# EAGLE schematic ArduSatMultipleProcessorModule (EAGLE 6.3)
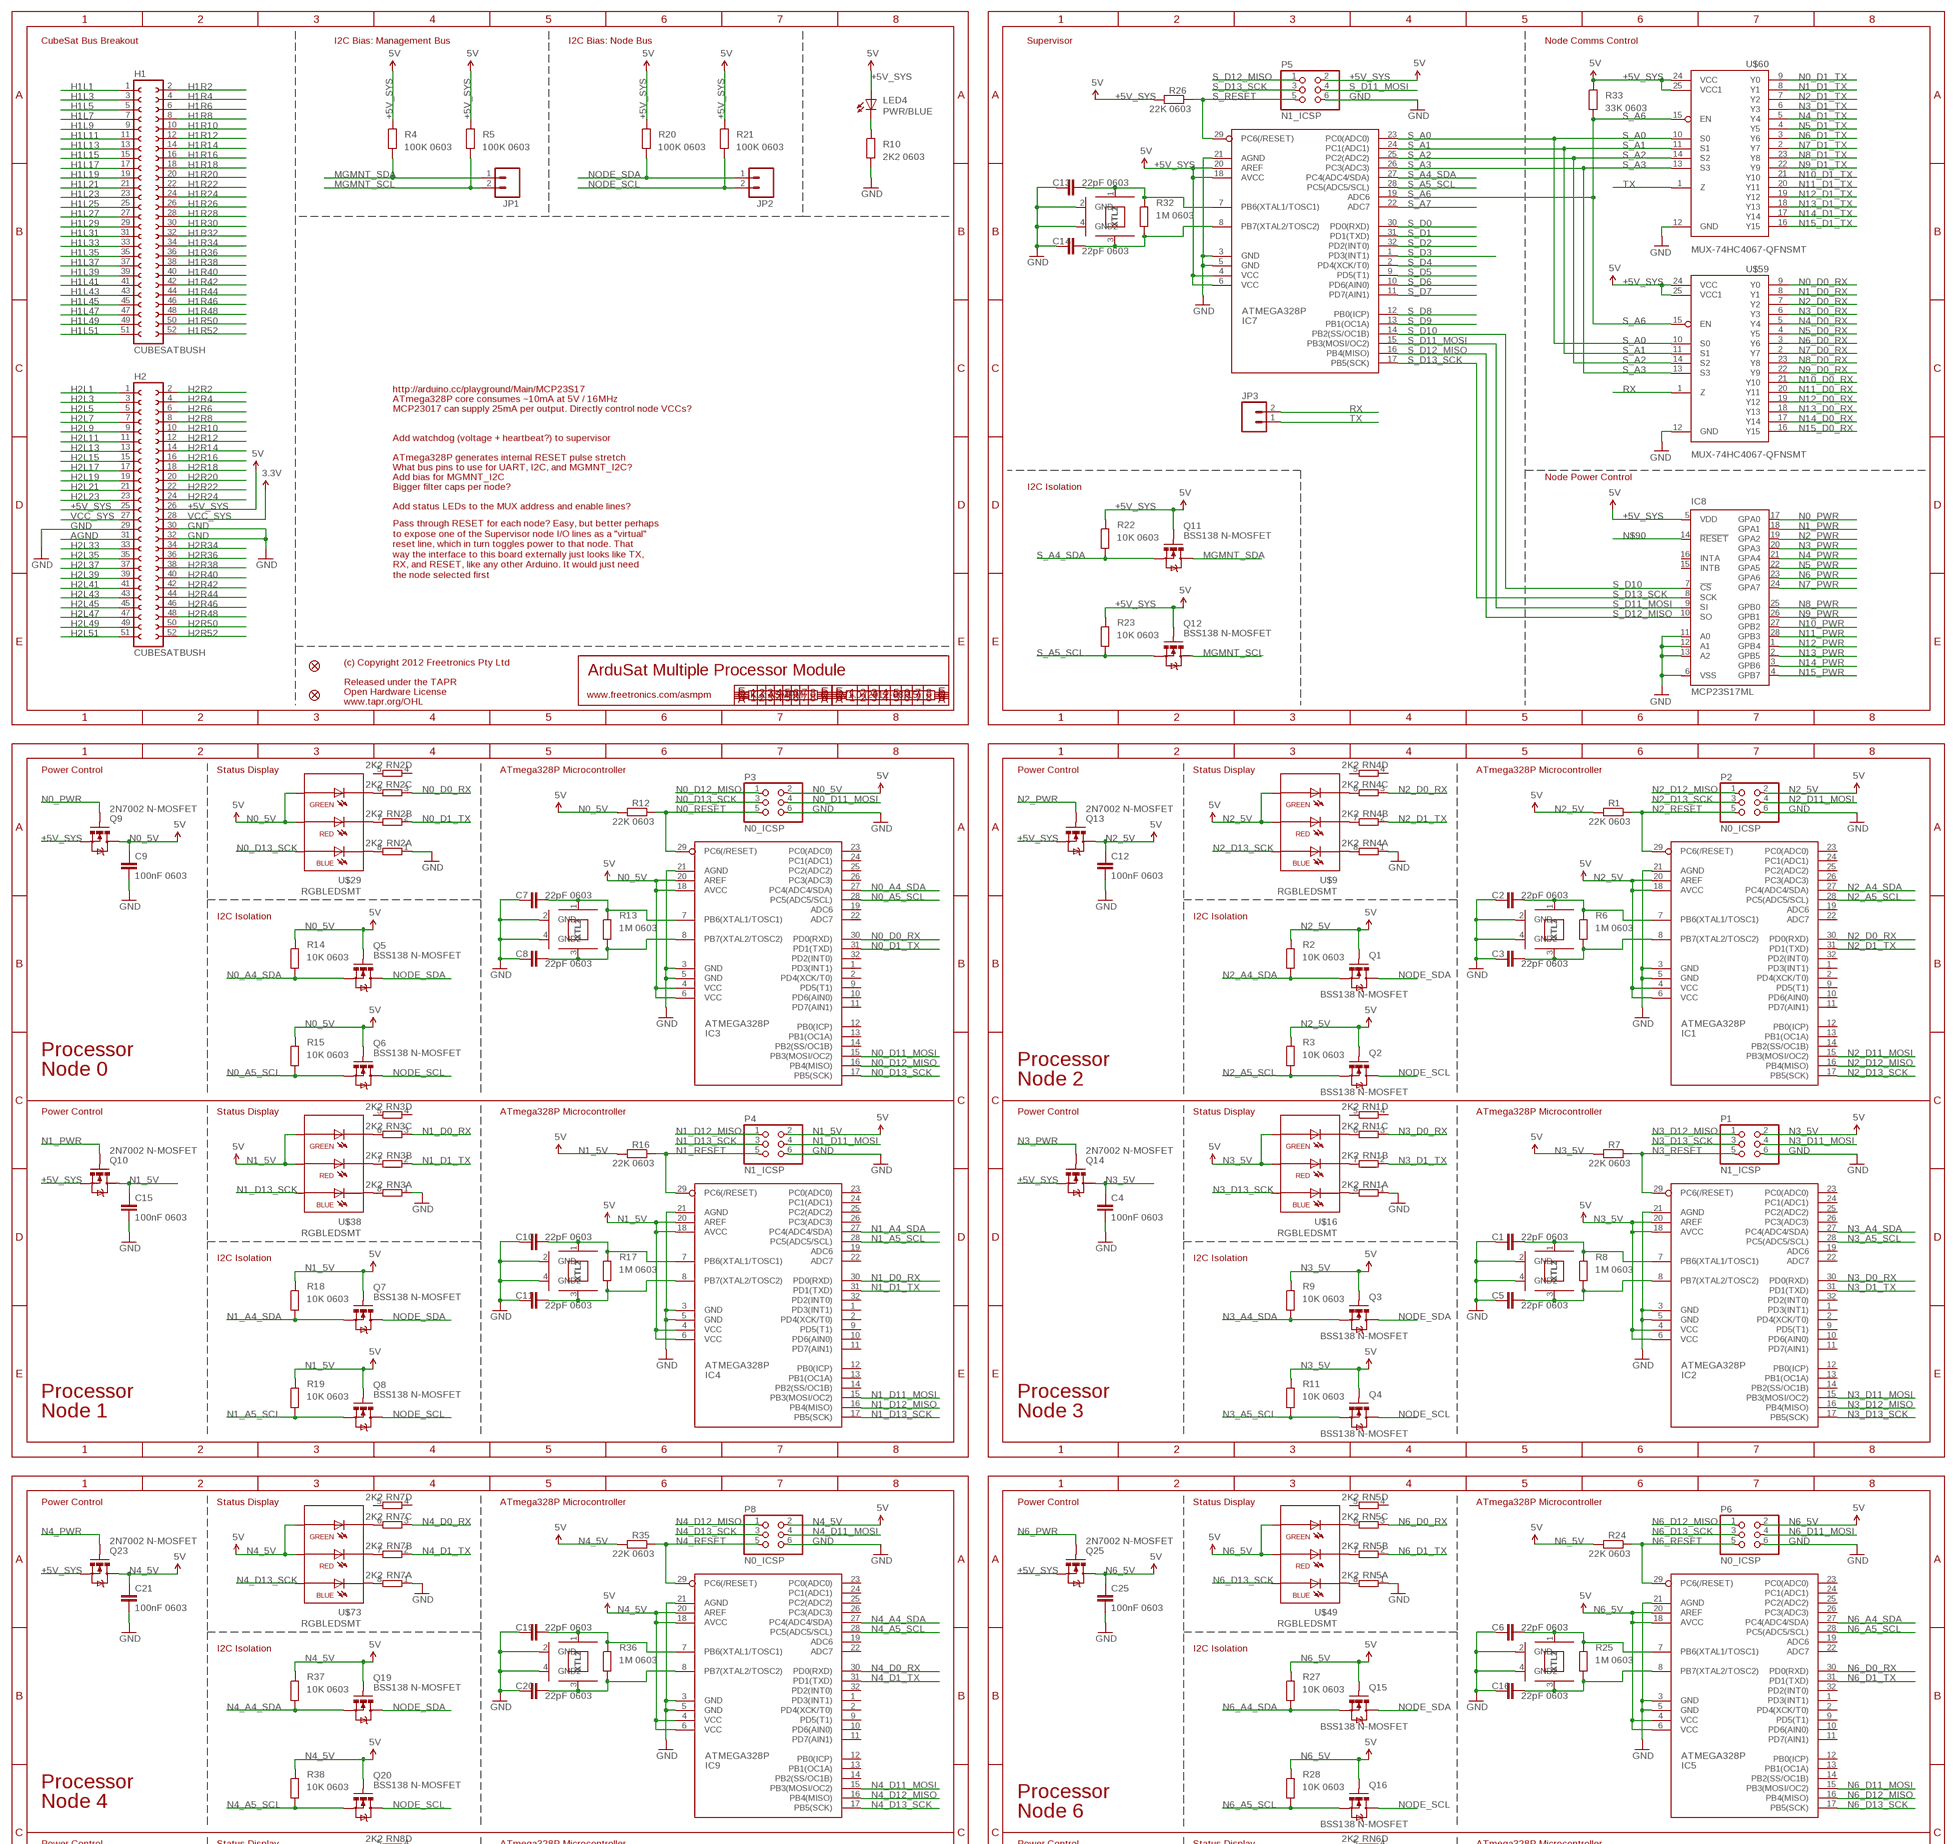
[diagram p0: schematic, sheet 1, part 1 of 2]
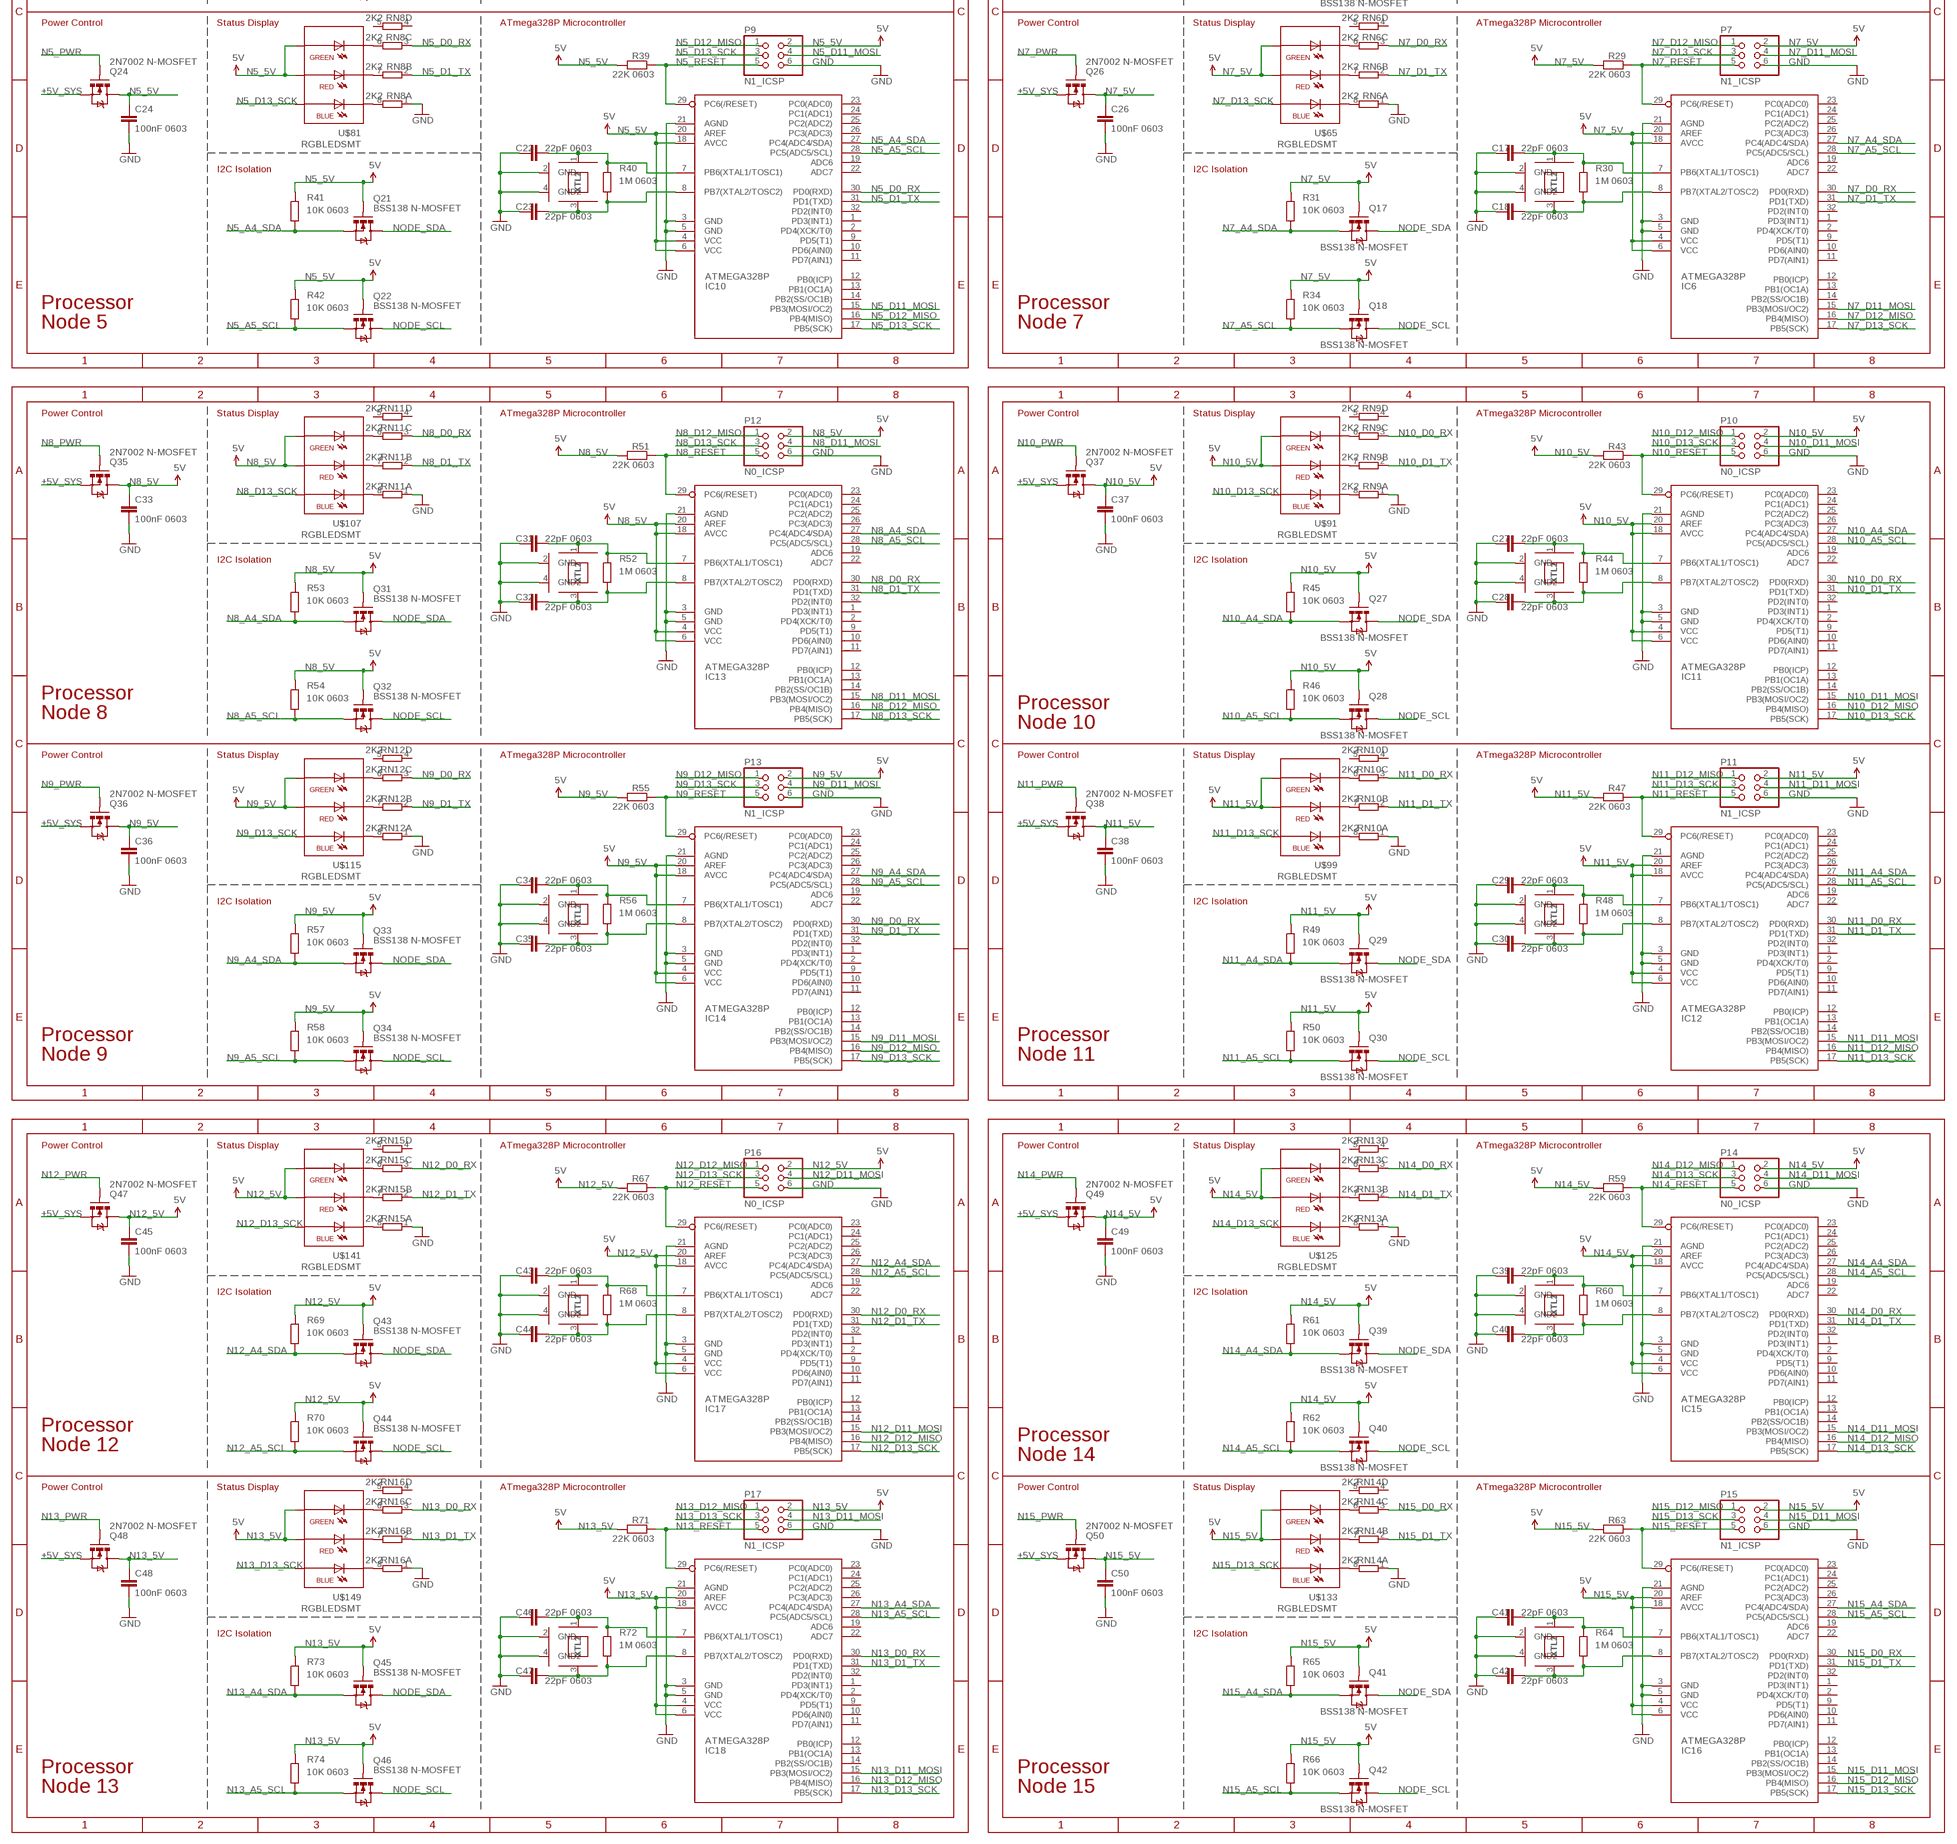
[diagram p1: schematic, sheet 1, part 2 of 2]

## Parts
C1  22pF 0603  CAP0603  [0603]
C2  22pF 0603  CAP0603  [0603]
C3  22pF 0603  CAP0603  [0603]
C4  100nF 0603  CAP0603  [0603]
C5  22pF 0603  CAP0603  [0603]
C6  22pF 0603  CAP0603  [0603]
C7  22pF 0603  CAP0603  [0603]
C8  22pF 0603  CAP0603  [0603]
C9  100nF 0603  CAP0603  [0603]
C10  22pF 0603  CAP0603  [0603]
C11  22pF 0603  CAP0603  [0603]
C12  100nF 0603  CAP0603  [0603]
C13  22pF 0603  CAP0603  [0603]
C14  22pF 0603  CAP0603  [0603]
C15  100nF 0603  CAP0603  [0603]
C16  22pF 0603  CAP0603  [0603]
C17  22pF 0603  CAP0603  [0603]
C18  22pF 0603  CAP0603  [0603]
C19  22pF 0603  CAP0603  [0603]
C20  22pF 0603  CAP0603  [0603]
C21  100nF 0603  CAP0603  [0603]
C22  22pF 0603  CAP0603  [0603]
C23  22pF 0603  CAP0603  [0603]
C24  100nF 0603  CAP0603  [0603]
C25  100nF 0603  CAP0603  [0603]
C26  100nF 0603  CAP0603  [0603]
C27  22pF 0603  CAP0603  [0603]
C28  22pF 0603  CAP0603  [0603]
C29  22pF 0603  CAP0603  [0603]
C30  22pF 0603  CAP0603  [0603]
C31  22pF 0603  CAP0603  [0603]
C32  22pF 0603  CAP0603  [0603]
C33  100nF 0603  CAP0603  [0603]
C34  22pF 0603  CAP0603  [0603]
C35  22pF 0603  CAP0603  [0603]
C36  100nF 0603  CAP0603  [0603]
C37  100nF 0603  CAP0603  [0603]
C38  100nF 0603  CAP0603  [0603]
C39  22pF 0603  CAP0603  [0603]
C40  22pF 0603  CAP0603  [0603]
C41  22pF 0603  CAP0603  [0603]
C42  22pF 0603  CAP0603  [0603]
C43  22pF 0603  CAP0603  [0603]
C44  22pF 0603  CAP0603  [0603]
C45  100nF 0603  CAP0603  [0603]
C46  22pF 0603  CAP0603  [0603]
C47  22pF 0603  CAP0603  [0603]
C48  100nF 0603  CAP0603  [0603]
C49  100nF 0603  CAP0603  [0603]
C50  100nF 0603  CAP0603  [0603]
H1  CUBESATBUSH  [CUBESATBUS]
H2  CUBESATBUSH  [CUBESATBUS]
IC1  ATMEGA328P  AVR-MEGA8-MI  [MLF32]
IC2  ATMEGA328P  AVR-MEGA8-MI  [MLF32]
IC3  ATMEGA328P  AVR-MEGA8-MI  [MLF32]
IC4  ATMEGA328P  AVR-MEGA8-MI  [MLF32]
IC5  ATMEGA328P  AVR-MEGA8-MI  [MLF32]
IC6  ATMEGA328P  AVR-MEGA8-MI  [MLF32]
IC7  ATMEGA328P  AVR-MEGA8-MI  [MLF32]
IC8  MCP23S17ML  [QFN28-ML_6X6MM]
IC9  ATMEGA328P  AVR-MEGA8-MI  [MLF32]
IC10  ATMEGA328P  AVR-MEGA8-MI  [MLF32]
IC11  ATMEGA328P  AVR-MEGA8-MI  [MLF32]
IC12  ATMEGA328P  AVR-MEGA8-MI  [MLF32]
IC13  ATMEGA328P  AVR-MEGA8-MI  [MLF32]
IC14  ATMEGA328P  AVR-MEGA8-MI  [MLF32]
IC15  ATMEGA328P  AVR-MEGA8-MI  [MLF32]
IC16  ATMEGA328P  AVR-MEGA8-MI  [MLF32]
IC17  ATMEGA328P  AVR-MEGA8-MI  [MLF32]
IC18  ATMEGA328P  AVR-MEGA8-MI  [MLF32]
JP1  M02PTH  [1X02]
JP2  M02PTH  [1X02]
JP3  M02PTH  [1X02]
LED4  PWR/BLUE  LED0603  [LED-0603]
P1  N1_ICSP  ICSPPTH  [2X03PTH]
P2  N0_ICSP  ICSPPTH  [2X03PTH]
P3  N0_ICSP  ICSPPTH  [2X03PTH]
P4  N1_ICSP  ICSPPTH  [2X03PTH]
P5  N1_ICSP  ICSPPTH  [2X03PTH]
P6  N0_ICSP  ICSPPTH  [2X03PTH]
P7  N1_ICSP  ICSPPTH  [2X03PTH]
P8  N0_ICSP  ICSPPTH  [2X03PTH]
P9  N1_ICSP  ICSPPTH  [2X03PTH]
P10  N0_ICSP  ICSPPTH  [2X03PTH]
P11  N1_ICSP  ICSPPTH  [2X03PTH]
P12  N0_ICSP  ICSPPTH  [2X03PTH]
P13  N1_ICSP  ICSPPTH  [2X03PTH]
P14  N0_ICSP  ICSPPTH  [2X03PTH]
P15  N1_ICSP  ICSPPTH  [2X03PTH]
P16  N0_ICSP  ICSPPTH  [2X03PTH]
P17  N1_ICSP  ICSPPTH  [2X03PTH]
Q1  BSS138 N-MOSFET  MOSFET-NCHANNELSMD  [SOT23-3]
Q2  BSS138 N-MOSFET  MOSFET-NCHANNELSMD  [SOT23-3]
Q3  BSS138 N-MOSFET  MOSFET-NCHANNELSMD  [SOT23-3]
Q4  BSS138 N-MOSFET  MOSFET-NCHANNELSMD  [SOT23-3]
Q5  BSS138 N-MOSFET  MOSFET-NCHANNELSMD  [SOT23-3]
Q6  BSS138 N-MOSFET  MOSFET-NCHANNELSMD  [SOT23-3]
Q7  BSS138 N-MOSFET  MOSFET-NCHANNELSMD  [SOT23-3]
Q8  BSS138 N-MOSFET  MOSFET-NCHANNELSMD  [SOT23-3]
Q9  2N7002 N-MOSFET  MOSFET-NCHANNELSMD  [SOT23-3]
Q10  2N7002 N-MOSFET  MOSFET-NCHANNELSMD  [SOT23-3]
Q11  BSS138 N-MOSFET  MOSFET-NCHANNELSMD  [SOT23-3]
Q12  BSS138 N-MOSFET  MOSFET-NCHANNELSMD  [SOT23-3]
Q13  2N7002 N-MOSFET  MOSFET-NCHANNELSMD  [SOT23-3]
Q14  2N7002 N-MOSFET  MOSFET-NCHANNELSMD  [SOT23-3]
Q15  BSS138 N-MOSFET  MOSFET-NCHANNELSMD  [SOT23-3]
Q16  BSS138 N-MOSFET  MOSFET-NCHANNELSMD  [SOT23-3]
Q17  BSS138 N-MOSFET  MOSFET-NCHANNELSMD  [SOT23-3]
Q18  BSS138 N-MOSFET  MOSFET-NCHANNELSMD  [SOT23-3]
Q19  BSS138 N-MOSFET  MOSFET-NCHANNELSMD  [SOT23-3]
Q20  BSS138 N-MOSFET  MOSFET-NCHANNELSMD  [SOT23-3]
Q21  BSS138 N-MOSFET  MOSFET-NCHANNELSMD  [SOT23-3]
Q22  BSS138 N-MOSFET  MOSFET-NCHANNELSMD  [SOT23-3]
Q23  2N7002 N-MOSFET  MOSFET-NCHANNELSMD  [SOT23-3]
Q24  2N7002 N-MOSFET  MOSFET-NCHANNELSMD  [SOT23-3]
Q25  2N7002 N-MOSFET  MOSFET-NCHANNELSMD  [SOT23-3]
Q26  2N7002 N-MOSFET  MOSFET-NCHANNELSMD  [SOT23-3]
Q27  BSS138 N-MOSFET  MOSFET-NCHANNELSMD  [SOT23-3]
Q28  BSS138 N-MOSFET  MOSFET-NCHANNELSMD  [SOT23-3]
Q29  BSS138 N-MOSFET  MOSFET-NCHANNELSMD  [SOT23-3]
Q30  BSS138 N-MOSFET  MOSFET-NCHANNELSMD  [SOT23-3]
Q31  BSS138 N-MOSFET  MOSFET-NCHANNELSMD  [SOT23-3]
Q32  BSS138 N-MOSFET  MOSFET-NCHANNELSMD  [SOT23-3]
Q33  BSS138 N-MOSFET  MOSFET-NCHANNELSMD  [SOT23-3]
Q34  BSS138 N-MOSFET  MOSFET-NCHANNELSMD  [SOT23-3]
Q35  2N7002 N-MOSFET  MOSFET-NCHANNELSMD  [SOT23-3]
Q36  2N7002 N-MOSFET  MOSFET-NCHANNELSMD  [SOT23-3]
Q37  2N7002 N-MOSFET  MOSFET-NCHANNELSMD  [SOT23-3]
Q38  2N7002 N-MOSFET  MOSFET-NCHANNELSMD  [SOT23-3]
Q39  BSS138 N-MOSFET  MOSFET-NCHANNELSMD  [SOT23-3]
Q40  BSS138 N-MOSFET  MOSFET-NCHANNELSMD  [SOT23-3]
Q41  BSS138 N-MOSFET  MOSFET-NCHANNELSMD  [SOT23-3]
Q42  BSS138 N-MOSFET  MOSFET-NCHANNELSMD  [SOT23-3]
Q43  BSS138 N-MOSFET  MOSFET-NCHANNELSMD  [SOT23-3]
Q44  BSS138 N-MOSFET  MOSFET-NCHANNELSMD  [SOT23-3]
Q45  BSS138 N-MOSFET  MOSFET-NCHANNELSMD  [SOT23-3]
Q46  BSS138 N-MOSFET  MOSFET-NCHANNELSMD  [SOT23-3]
Q47  2N7002 N-MOSFET  MOSFET-NCHANNELSMD  [SOT23-3]
Q48  2N7002 N-MOSFET  MOSFET-NCHANNELSMD  [SOT23-3]
Q49  2N7002 N-MOSFET  MOSFET-NCHANNELSMD  [SOT23-3]
Q50  2N7002 N-MOSFET  MOSFET-NCHANNELSMD  [SOT23-3]
R1  22K 0603  RESISTOR0603  [0603]
R2  10K 0603  RESISTOR0603  [0603]
R3  10K 0603  RESISTOR0603  [0603]
R4  100K 0603  RESISTOR0603  [0603]
R5  100K 0603  RESISTOR0603  [0603]
R6  1M 0603  RESISTOR0603  [0603]
R7  22K 0603  RESISTOR0603  [0603]
R8  1M 0603  RESISTOR0603  [0603]
R9  10K 0603  RESISTOR0603  [0603]
R10  2K2 0603  RESISTOR0603  [0603]
R11  10K 0603  RESISTOR0603  [0603]
R12  22K 0603  RESISTOR0603  [0603]
R13  1M 0603  RESISTOR0603  [0603]
R14  10K 0603  RESISTOR0603  [0603]
R15  10K 0603  RESISTOR0603  [0603]
R16  22K 0603  RESISTOR0603  [0603]
R17  1M 0603  RESISTOR0603  [0603]
R18  10K 0603  RESISTOR0603  [0603]
R19  10K 0603  RESISTOR0603  [0603]
R20  100K 0603  RESISTOR0603  [0603]
R21  100K 0603  RESISTOR0603  [0603]
R22  10K 0603  RESISTOR0603  [0603]
R23  10K 0603  RESISTOR0603  [0603]
R24  22K 0603  RESISTOR0603  [0603]
R25  1M 0603  RESISTOR0603  [0603]
R26  22K 0603  RESISTOR0603  [0603]
R27  10K 0603  RESISTOR0603  [0603]
R28  10K 0603  RESISTOR0603  [0603]
R29  22K 0603  RESISTOR0603  [0603]
R30  1M 0603  RESISTOR0603  [0603]
R31  10K 0603  RESISTOR0603  [0603]
R32  1M 0603  RESISTOR0603  [0603]
R33  33K 0603  RESISTOR0603  [0603]
R34  10K 0603  RESISTOR0603  [0603]
R35  22K 0603  RESISTOR0603  [0603]
R36  1M 0603  RESISTOR0603  [0603]
R37  10K 0603  RESISTOR0603  [0603]
R38  10K 0603  RESISTOR0603  [0603]
R39  22K 0603  RESISTOR0603  [0603]
R40  1M 0603  RESISTOR0603  [0603]
R41  10K 0603  RESISTOR0603  [0603]
R42  10K 0603  RESISTOR0603  [0603]
R43  22K 0603  RESISTOR0603  [0603]
R44  1M 0603  RESISTOR0603  [0603]
R45  10K 0603  RESISTOR0603  [0603]
R46  10K 0603  RESISTOR0603  [0603]
R47  22K 0603  RESISTOR0603  [0603]
R48  1M 0603  RESISTOR0603  [0603]
R49  10K 0603  RESISTOR0603  [0603]
R50  10K 0603  RESISTOR0603  [0603]
R51  22K 0603  RESISTOR0603  [0603]
R52  1M 0603  RESISTOR0603  [0603]
R53  10K 0603  RESISTOR0603  [0603]
R54  10K 0603  RESISTOR0603  [0603]
R55  22K 0603  RESISTOR0603  [0603]
R56  1M 0603  RESISTOR0603  [0603]
R57  10K 0603  RESISTOR0603  [0603]
R58  10K 0603  RESISTOR0603  [0603]
R59  22K 0603  RESISTOR0603  [0603]
R60  1M 0603  RESISTOR0603  [0603]
R61  10K 0603  RESISTOR0603  [0603]
R62  10K 0603  RESISTOR0603  [0603]
R63  22K 0603  RESISTOR0603  [0603]
R64  1M 0603  RESISTOR0603  [0603]
R65  10K 0603  RESISTOR0603  [0603]
R66  10K 0603  RESISTOR0603  [0603]
R67  22K 0603  RESISTOR0603  [0603]
R68  1M 0603  RESISTOR0603  [0603]
R69  10K 0603  RESISTOR0603  [0603]
R70  10K 0603  RESISTOR0603  [0603]
R71  22K 0603  RESISTOR0603  [0603]
R72  1M 0603  RESISTOR0603  [0603]
R73  10K 0603  RESISTOR0603  [0603]
R74  10K 0603  RESISTOR0603  [0603]
RN1  2K2  4R-NCAY16  [CAY16]
RN2  2K2  4R-NCAY16  [CAY16]
RN3  2K2  4R-NCAY16  [CAY16]
RN4  2K2  4R-NCAY16  [CAY16]
RN5  2K2  4R-NCAY16  [CAY16]
RN6  2K2  4R-NCAY16  [CAY16]
RN7  2K2  4R-NCAY16  [CAY16]
RN8  2K2  4R-NCAY16  [CAY16]
RN9  2K2  4R-NCAY16  [CAY16]
RN10  2K2  4R-NCAY16  [CAY16]
RN11  2K2  4R-NCAY16  [CAY16]
RN12  2K2  4R-NCAY16  [CAY16]
RN13  2K2  4R-NCAY16  [CAY16]
RN14  2K2  4R-NCAY16  [CAY16]
RN15  2K2  4R-NCAY16  [CAY16]
RN16  2K2  4R-NCAY16  [CAY16]
U$1  CRYSTAL-GND3X2  [CRYSTAL-SMD-3X2]
U$9  RGBLEDSMT  [19-337]
U$15  CRYSTAL-GND3X2  [CRYSTAL-SMD-3X2]
U$16  RGBLEDSMT  [19-337]
U$21  FIDUCIAL1X2.5  [FIDUCIAL-1X2.5]
U$22  FIDUCIAL1X2.5  [FIDUCIAL-1X2.5]
U$28  CRYSTAL-GND3X2  [CRYSTAL-SMD-3X2]
U$29  RGBLEDSMT  [19-337]
U$37  CRYSTAL-GND3X2  [CRYSTAL-SMD-3X2]
U$38  RGBLEDSMT  [19-337]
U$48  CRYSTAL-GND3X2  [CRYSTAL-SMD-3X2]
U$49  RGBLEDSMT  [19-337]
U$53  CRYSTAL-GND3X2  [CRYSTAL-SMD-3X2]
U$59  MUX-74HC4067-QFNSMT  [DHVQFN24]
U$60  MUX-74HC4067-QFNSMT  [DHVQFN24]
U$64  CRYSTAL-GND3X2  [CRYSTAL-SMD-3X2]
U$65  RGBLEDSMT  [19-337]
U$72  CRYSTAL-GND3X2  [CRYSTAL-SMD-3X2]
U$73  RGBLEDSMT  [19-337]
U$80  CRYSTAL-GND3X2  [CRYSTAL-SMD-3X2]
U$81  RGBLEDSMT  [19-337]
U$90  CRYSTAL-GND3X2  [CRYSTAL-SMD-3X2]
U$91  RGBLEDSMT  [19-337]
U$98  CRYSTAL-GND3X2  [CRYSTAL-SMD-3X2]
U$99  RGBLEDSMT  [19-337]
U$106  CRYSTAL-GND3X2  [CRYSTAL-SMD-3X2]
U$107  RGBLEDSMT  [19-337]
U$114  CRYSTAL-GND3X2  [CRYSTAL-SMD-3X2]
U$115  RGBLEDSMT  [19-337]
U$124  CRYSTAL-GND3X2  [CRYSTAL-SMD-3X2]
U$125  RGBLEDSMT  [19-337]
U$132  CRYSTAL-GND3X2  [CRYSTAL-SMD-3X2]
U$133  RGBLEDSMT  [19-337]
U$140  CRYSTAL-GND3X2  [CRYSTAL-SMD-3X2]
U$141  RGBLEDSMT  [19-337]
U$148  CRYSTAL-GND3X2  [CRYSTAL-SMD-3X2]
U$149  RGBLEDSMT  [19-337]

## Nets
+5V_SYS: H2.25 H2.26 IC7.4(VCC) IC7.6(VCC) IC7.18(AVCC) IC7.20(AREF) IC8.5(VDD) LED4.A P5.2 Q9.2(S) Q10.2(S) Q11.1(G) Q12.1(G) Q13.2(S) Q14.2(S) Q23.2(S) Q24.2(S) Q25.2(S) Q26.2(S) Q35.2(S) Q36.2(S) Q37.2(S) Q38.2(S) Q47.2(S) Q48.2(S) Q49.2(S) Q50.2(S) R4.2 R5.2 R20.2 R21.2 R22.2 R23.2 R26.2 R33.2 U$59.24(VCC) U$59.25(VCC1) U$60.24(VCC) U$60.25(VCC1) ; supply symbol labelled 5V
AGND: H2.31
GND: C1.1 C2.1 C3.1 C4.2 C5.1 C6.1 C7.1 C8.1 C9.2 C10.1 C11.1 C12.2 C13.1 C14.1 C15.2 C16.1 C17.1 C18.1 C19.1 C20.1 C21.2 C22.1 C23.1 C24.2 C25.2 C26.2 C27.1 C28.1 C29.1 C30.1 C31.1 C32.1 C33.2 C34.1 C35.1 C36.2 C37.2 C38.2 C39.1 C40.1 C41.1 C42.1 C43.1 C44.1 C45.2 C46.1 C47.1 C48.2 C49.2 C50.2 H2.29 H2.30 H2.32 IC1.3(GND) IC1.5(GND) IC1.21(AGND) IC2.3(GND) IC2.5(GND) IC2.21(AGND) IC3.3(GND) IC3.5(GND) IC3.21(AGND) IC4.3(GND) IC4.5(GND) IC4.21(AGND) IC5.3(GND) IC5.5(GND) IC5.21(AGND) IC6.3(GND) IC6.5(GND) IC6.21(AGND) IC7.3(GND) IC7.5(GND) IC7.21(AGND) IC8.6(VSS) IC8.11(A0) IC8.12(A1) IC8.13(A2) IC9.3(GND) IC9.5(GND) IC9.21(AGND) IC10.3(GND) IC10.5(GND) IC10.21(AGND) IC11.3(GND) IC11.5(GND) IC11.21(AGND) IC12.3(GND) IC12.5(GND) IC12.21(AGND) IC13.3(GND) IC13.5(GND) IC13.21(AGND) IC14.3(GND) IC14.5(GND) IC14.21(AGND) IC15.3(GND) IC15.5(GND) IC15.21(AGND) IC16.3(GND) IC16.5(GND) IC16.21(AGND) IC17.3(GND) IC17.5(GND) IC17.21(AGND) IC18.3(GND) IC18.5(GND) IC18.21(AGND) P1.6 P2.6 P3.6 P4.6 P5.6 P6.6 P7.6 P8.6 P9.6 P10.6 P11.6 P12.6 P13.6 P14.6 P15.6 P16.6 P17.6 R10.1 RN1.1 RN2.1 RN3.1 RN4.1 RN5.1 RN6.1 RN7.1 RN8.1 RN9.1 RN10.1 RN11.1 RN12.1 RN13.1 RN14.1 RN15.1 RN16.1 U$1.2(GND) U$1.4(GND2) U$15.2(GND) U$15.4(GND2) U$28.2(GND) U$28.4(GND2) U$37.2(GND) U$37.4(GND2) U$48.2(GND) U$48.4(GND2) U$53.2(GND) U$53.4(GND2) U$59.12(GND) U$60.12(GND) U$64.2(GND) U$64.4(GND2) U$72.2(GND) U$72.4(GND2) U$80.2(GND) U$80.4(GND2) U$90.2(GND) U$90.4(GND2) U$98.2(GND) U$98.4(GND2) U$106.2(GND) U$106.4(GND2) U$114.2(GND) U$114.4(GND2) U$124.2(GND) U$124.4(GND2) U$132.2(GND) U$132.4(GND2) U$140.2(GND) U$140.4(GND2) U$148.2(GND) U$148.4(GND2)
H1L1: H1.1
H1L3: H1.3
H1L5: H1.5
H1L7: H1.7
H1L9: H1.9
H1L11: H1.11
H1L13: H1.13
H1L15: H1.15
H1L17: H1.17
H1L19: H1.19
H1L21: H1.21
H1L23: H1.23
H1L25: H1.25
H1L27: H1.27
H1L29: H1.29
H1L31: H1.31
H1L33: H1.33
H1L35: H1.35
H1L37: H1.37
H1L39: H1.39
H1L41: H1.41
H1L43: H1.43
H1L45: H1.45
H1L47: H1.47
H1L49: H1.49
H1L51: H1.51
H1R2: H1.2
H1R4: H1.4
H1R6: H1.6
H1R8: H1.8
H1R10: H1.10
H1R12: H1.12
H1R14: H1.14
H1R16: H1.16
H1R18: H1.18
H1R20: H1.20
H1R22: H1.22
H1R24: H1.24
H1R26: H1.26
H1R28: H1.28
H1R30: H1.30
H1R32: H1.32
H1R34: H1.34
H1R36: H1.36
H1R38: H1.38
H1R40: H1.40
H1R42: H1.42
H1R44: H1.44
H1R46: H1.46
H1R48: H1.48
H1R50: H1.50
H1R52: H1.52
H2L1: H2.1
H2L3: H2.3
H2L5: H2.5
H2L7: H2.7
H2L9: H2.9
H2L11: H2.11
H2L13: H2.13
H2L15: H2.15
H2L17: H2.17
H2L19: H2.19
H2L21: H2.21
H2L23: H2.23
H2L33: H2.33
H2L35: H2.35
H2L37: H2.37
H2L39: H2.39
H2L41: H2.41
H2L43: H2.43
H2L45: H2.45
H2L47: H2.47
H2L49: H2.49
H2L51: H2.51
H2R2: H2.2
H2R4: H2.4
H2R6: H2.6
H2R8: H2.8
H2R10: H2.10
H2R12: H2.12
H2R14: H2.14
H2R16: H2.16
H2R18: H2.18
H2R20: H2.20
H2R22: H2.22
H2R24: H2.24
H2R34: H2.34
H2R36: H2.36
H2R38: H2.38
H2R40: H2.40
H2R42: H2.42
H2R44: H2.44
H2R46: H2.46
H2R48: H2.48
H2R50: H2.50
H2R52: H2.52
MGMNT_SCL: JP1.2 Q12.3(D) R5.1
MGMNT_SDA: JP1.1 Q11.3(D) R4.1
N0_5V: C9.1 IC3.4(VCC) IC3.6(VCC) IC3.18(AVCC) IC3.20(AREF) P3.2 Q5.1(G) Q6.1(G) Q9.3(D) R12.2 R14.2 R15.2 U$29.5(A-R) U$29.6(A-G) ; supply symbol labelled 5V
N0_A4_SDA: IC3.27(PC4(ADC4/SDA)) Q5.2(S) R14.1
N0_A5_SCL: IC3.28(PC5(ADC5/SCL)) Q6.2(S) R15.1
N0_D0_RX: IC3.30(PD0(RXD)) RN2.3 U$59.9(Y0)
N0_D1_TX: IC3.31(PD1(TXD)) RN2.2 U$60.9(Y0)
N0_D11_MOSI: IC3.15(PB3(MOSI/OC2)) P3.4
N0_D12_MISO: IC3.16(PB4(MISO)) P3.1
N0_D13_SCK: IC3.17(PB5(SCK)) P3.3 U$29.4(A-B)
N0_PWR: IC8.17(GPA0) Q9.1(G)
N0_RESET: IC3.29(PC6(/RESET)) P3.5 R12.1
N1_5V: C15.1 IC4.4(VCC) IC4.6(VCC) IC4.18(AVCC) IC4.20(AREF) P4.2 Q7.1(G) Q8.1(G) Q10.3(D) R16.2 R18.2 R19.2 U$38.5(A-R) U$38.6(A-G) ; supply symbol labelled 5V
N1_A4_SDA: IC4.27(PC4(ADC4/SDA)) Q7.2(S) R18.1
N1_A5_SCL: IC4.28(PC5(ADC5/SCL)) Q8.2(S) R19.1
N1_D0_RX: IC4.30(PD0(RXD)) RN3.3 U$59.8(Y1)
N1_D1_TX: IC4.31(PD1(TXD)) RN3.2 U$60.8(Y1)
N1_D11_MOSI: IC4.15(PB3(MOSI/OC2)) P4.4
N1_D12_MISO: IC4.16(PB4(MISO)) P4.1
N1_D13_SCK: IC4.17(PB5(SCK)) P4.3 U$38.4(A-B)
N1_PWR: IC8.18(GPA1) Q10.1(G)
N1_RESET: IC4.29(PC6(/RESET)) P4.5 R16.1
N2_5V: C12.1 IC1.4(VCC) IC1.6(VCC) IC1.18(AVCC) IC1.20(AREF) P2.2 Q1.1(G) Q2.1(G) Q13.3(D) R1.2 R2.2 R3.2 U$9.5(A-R) U$9.6(A-G) ; supply symbol labelled 5V
N2_A4_SDA: IC1.27(PC4(ADC4/SDA)) Q1.2(S) R2.1
N2_A5_SCL: IC1.28(PC5(ADC5/SCL)) Q2.2(S) R3.1
N2_D0_RX: IC1.30(PD0(RXD)) RN4.3 U$59.7(Y2)
N2_D1_TX: IC1.31(PD1(TXD)) RN4.2 U$60.7(Y2)
N2_D11_MOSI: IC1.15(PB3(MOSI/OC2)) P2.4
N2_D12_MISO: IC1.16(PB4(MISO)) P2.1
N2_D13_SCK: IC1.17(PB5(SCK)) P2.3 U$9.4(A-B)
N2_PWR: IC8.19(GPA2) Q13.1(G)
N2_RESET: IC1.29(PC6(/RESET)) P2.5 R1.1
N3_5V: C4.1 IC2.4(VCC) IC2.6(VCC) IC2.18(AVCC) IC2.20(AREF) P1.2 Q3.1(G) Q4.1(G) Q14.3(D) R7.2 R9.2 R11.2 U$16.5(A-R) U$16.6(A-G) ; supply symbol labelled 5V
N3_A4_SDA: IC2.27(PC4(ADC4/SDA)) Q3.2(S) R9.1
N3_A5_SCL: IC2.28(PC5(ADC5/SCL)) Q4.2(S) R11.1
N3_D0_RX: IC2.30(PD0(RXD)) RN1.3 U$59.6(Y3)
N3_D1_TX: IC2.31(PD1(TXD)) RN1.2 U$60.6(Y3)
N3_D11_MOSI: IC2.15(PB3(MOSI/OC2)) P1.4
N3_D12_MISO: IC2.16(PB4(MISO)) P1.1
N3_D13_SCK: IC2.17(PB5(SCK)) P1.3 U$16.4(A-B)
N3_PWR: IC8.20(GPA3) Q14.1(G)
N3_RESET: IC2.29(PC6(/RESET)) P1.5 R7.1
N4_5V: C21.1 IC9.4(VCC) IC9.6(VCC) IC9.18(AVCC) IC9.20(AREF) P8.2 Q19.1(G) Q20.1(G) Q23.3(D) R35.2 R37.2 R38.2 U$73.5(A-R) U$73.6(A-G) ; supply symbol labelled 5V
N4_A4_SDA: IC9.27(PC4(ADC4/SDA)) Q19.2(S) R37.1
N4_A5_SCL: IC9.28(PC5(ADC5/SCL)) Q20.2(S) R38.1
N4_D0_RX: IC9.30(PD0(RXD)) RN7.3 U$59.5(Y4)
N4_D1_TX: IC9.31(PD1(TXD)) RN7.2 U$60.5(Y4)
N4_D11_MOSI: IC9.15(PB3(MOSI/OC2)) P8.4
N4_D12_MISO: IC9.16(PB4(MISO)) P8.1
N4_D13_SCK: IC9.17(PB5(SCK)) P8.3 U$73.4(A-B)
N4_PWR: IC8.21(GPA4) Q23.1(G)
N4_RESET: IC9.29(PC6(/RESET)) P8.5 R35.1
N5_5V: C24.1 IC10.4(VCC) IC10.6(VCC) IC10.18(AVCC) IC10.20(AREF) P9.2 Q21.1(G) Q22.1(G) Q24.3(D) R39.2 R41.2 R42.2 U$81.5(A-R) U$81.6(A-G) ; supply symbol labelled 5V
N5_A4_SDA: IC10.27(PC4(ADC4/SDA)) Q21.2(S) R41.1
N5_A5_SCL: IC10.28(PC5(ADC5/SCL)) Q22.2(S) R42.1
N5_D0_RX: IC10.30(PD0(RXD)) RN8.3 U$59.4(Y5)
N5_D1_TX: IC10.31(PD1(TXD)) RN8.2 U$60.4(Y5)
N5_D11_MOSI: IC10.15(PB3(MOSI/OC2)) P9.4
N5_D12_MISO: IC10.16(PB4(MISO)) P9.1
N5_D13_SCK: IC10.17(PB5(SCK)) P9.3 U$81.4(A-B)
N5_PWR: IC8.22(GPA5) Q24.1(G)
N5_RESET: IC10.29(PC6(/RESET)) P9.5 R39.1
N6_5V: C25.1 IC5.4(VCC) IC5.6(VCC) IC5.18(AVCC) IC5.20(AREF) P6.2 Q15.1(G) Q16.1(G) Q25.3(D) R24.2 R27.2 R28.2 U$49.5(A-R) U$49.6(A-G) ; supply symbol labelled 5V
N6_A4_SDA: IC5.27(PC4(ADC4/SDA)) Q15.2(S) R27.1
N6_A5_SCL: IC5.28(PC5(ADC5/SCL)) Q16.2(S) R28.1
N6_D0_RX: IC5.30(PD0(RXD)) RN5.3 U$59.3(Y6)
N6_D1_TX: IC5.31(PD1(TXD)) RN5.2 U$60.3(Y6)
N6_D11_MOSI: IC5.15(PB3(MOSI/OC2)) P6.4
N6_D12_MISO: IC5.16(PB4(MISO)) P6.1
N6_D13_SCK: IC5.17(PB5(SCK)) P6.3 U$49.4(A-B)
N6_PWR: IC8.23(GPA6) Q25.1(G)
N6_RESET: IC5.29(PC6(/RESET)) P6.5 R24.1
N7_5V: C26.1 IC6.4(VCC) IC6.6(VCC) IC6.18(AVCC) IC6.20(AREF) P7.2 Q17.1(G) Q18.1(G) Q26.3(D) R29.2 R31.2 R34.2 U$65.5(A-R) U$65.6(A-G) ; supply symbol labelled 5V
N7_A4_SDA: IC6.27(PC4(ADC4/SDA)) Q17.2(S) R31.1
N7_A5_SCL: IC6.28(PC5(ADC5/SCL)) Q18.2(S) R34.1
N7_D0_RX: IC6.30(PD0(RXD)) RN6.3 U$59.2(Y7)
N7_D1_TX: IC6.31(PD1(TXD)) RN6.2 U$60.2(Y7)
N7_D11_MOSI: IC6.15(PB3(MOSI/OC2)) P7.4
N7_D12_MISO: IC6.16(PB4(MISO)) P7.1
N7_D13_SCK: IC6.17(PB5(SCK)) P7.3 U$65.4(A-B)
N7_PWR: IC8.24(GPA7) Q26.1(G)
N7_RESET: IC6.29(PC6(/RESET)) P7.5 R29.1
N8_5V: C33.1 IC13.4(VCC) IC13.6(VCC) IC13.18(AVCC) IC13.20(AREF) P12.2 Q31.1(G) Q32.1(G) Q35.3(D) R51.2 R53.2 R54.2 U$107.5(A-R) U$107.6(A-G) ; supply symbol labelled 5V
N8_A4_SDA: IC13.27(PC4(ADC4/SDA)) Q31.2(S) R53.1
N8_A5_SCL: IC13.28(PC5(ADC5/SCL)) Q32.2(S) R54.1
N8_D0_RX: IC13.30(PD0(RXD)) RN11.3 U$59.23(Y8)
N8_D1_TX: IC13.31(PD1(TXD)) RN11.2 U$60.23(Y8)
N8_D11_MOSI: IC13.15(PB3(MOSI/OC2)) P12.4
N8_D12_MISO: IC13.16(PB4(MISO)) P12.1
N8_D13_SCK: IC13.17(PB5(SCK)) P12.3 U$107.4(A-B)
N8_PWR: IC8.25(GPB0) Q35.1(G)
N8_RESET: IC13.29(PC6(/RESET)) P12.5 R51.1
N9_5V: C36.1 IC14.4(VCC) IC14.6(VCC) IC14.18(AVCC) IC14.20(AREF) P13.2 Q33.1(G) Q34.1(G) Q36.3(D) R55.2 R57.2 R58.2 U$115.5(A-R) U$115.6(A-G) ; supply symbol labelled 5V
N9_A4_SDA: IC14.27(PC4(ADC4/SDA)) Q33.2(S) R57.1
N9_A5_SCL: IC14.28(PC5(ADC5/SCL)) Q34.2(S) R58.1
N9_D0_RX: IC14.30(PD0(RXD)) RN12.3 U$59.22(Y9)
N9_D1_TX: IC14.31(PD1(TXD)) RN12.2 U$60.22(Y9)
N9_D11_MOSI: IC14.15(PB3(MOSI/OC2)) P13.4
N9_D12_MISO: IC14.16(PB4(MISO)) P13.1
N9_D13_SCK: IC14.17(PB5(SCK)) P13.3 U$115.4(A-B)
N9_PWR: IC8.26(GPB1) Q36.1(G)
N9_RESET: IC14.29(PC6(/RESET)) P13.5 R55.1
N10_5V: C37.1 IC11.4(VCC) IC11.6(VCC) IC11.18(AVCC) IC11.20(AREF) P10.2 Q27.1(G) Q28.1(G) Q37.3(D) R43.2 R45.2 R46.2 U$91.5(A-R) U$91.6(A-G) ; supply symbol labelled 5V
N10_A4_SDA: IC11.27(PC4(ADC4/SDA)) Q27.2(S) R45.1
N10_A5_SCL: IC11.28(PC5(ADC5/SCL)) Q28.2(S) R46.1
N10_D0_RX: IC11.30(PD0(RXD)) RN9.3 U$59.21(Y10)
N10_D1_TX: IC11.31(PD1(TXD)) RN9.2 U$60.21(Y10)
N10_D11_MOSI: IC11.15(PB3(MOSI/OC2)) P10.4
N10_D12_MISO: IC11.16(PB4(MISO)) P10.1
N10_D13_SCK: IC11.17(PB5(SCK)) P10.3 U$91.4(A-B)
N10_PWR: IC8.27(GPB2) Q37.1(G)
N10_RESET: IC11.29(PC6(/RESET)) P10.5 R43.1
N11_5V: C38.1 IC12.4(VCC) IC12.6(VCC) IC12.18(AVCC) IC12.20(AREF) P11.2 Q29.1(G) Q30.1(G) Q38.3(D) R47.2 R49.2 R50.2 U$99.5(A-R) U$99.6(A-G) ; supply symbol labelled 5V
N11_A4_SDA: IC12.27(PC4(ADC4/SDA)) Q29.2(S) R49.1
N11_A5_SCL: IC12.28(PC5(ADC5/SCL)) Q30.2(S) R50.1
N11_D0_RX: IC12.30(PD0(RXD)) RN10.3 U$59.20(Y11)
N11_D1_TX: IC12.31(PD1(TXD)) RN10.2 U$60.20(Y11)
N11_D11_MOSI: IC12.15(PB3(MOSI/OC2)) P11.4
N11_D12_MISO: IC12.16(PB4(MISO)) P11.1
N11_D13_SCK: IC12.17(PB5(SCK)) P11.3 U$99.4(A-B)
N11_PWR: IC8.28(GPB3) Q38.1(G)
N11_RESET: IC12.29(PC6(/RESET)) P11.5 R47.1
N12_5V: C45.1 IC17.4(VCC) IC17.6(VCC) IC17.18(AVCC) IC17.20(AREF) P16.2 Q43.1(G) Q44.1(G) Q47.3(D) R67.2 R69.2 R70.2 U$141.5(A-R) U$141.6(A-G) ; supply symbol labelled 5V
N12_A4_SDA: IC17.27(PC4(ADC4/SDA)) Q43.2(S) R69.1
N12_A5_SCL: IC17.28(PC5(ADC5/SCL)) Q44.2(S) R70.1
N12_D0_RX: IC17.30(PD0(RXD)) RN15.3 U$59.19(Y12)
N12_D1_TX: IC17.31(PD1(TXD)) RN15.2 U$60.19(Y12)
N12_D11_MOSI: IC17.15(PB3(MOSI/OC2)) P16.4
N12_D12_MISO: IC17.16(PB4(MISO)) P16.1
N12_D13_SCK: IC17.17(PB5(SCK)) P16.3 U$141.4(A-B)
N12_PWR: IC8.1(GPB4) Q47.1(G)
N12_RESET: IC17.29(PC6(/RESET)) P16.5 R67.1
N13_5V: C48.1 IC18.4(VCC) IC18.6(VCC) IC18.18(AVCC) IC18.20(AREF) P17.2 Q45.1(G) Q46.1(G) Q48.3(D) R71.2 R73.2 R74.2 U$149.5(A-R) U$149.6(A-G) ; supply symbol labelled 5V
N13_A4_SDA: IC18.27(PC4(ADC4/SDA)) Q45.2(S) R73.1
N13_A5_SCL: IC18.28(PC5(ADC5/SCL)) Q46.2(S) R74.1
N13_D0_RX: IC18.30(PD0(RXD)) RN16.3 U$59.18(Y13)
N13_D1_TX: IC18.31(PD1(TXD)) RN16.2 U$60.18(Y13)
N13_D11_MOSI: IC18.15(PB3(MOSI/OC2)) P17.4
N13_D12_MISO: IC18.16(PB4(MISO)) P17.1
N13_D13_SCK: IC18.17(PB5(SCK)) P17.3 U$149.4(A-B)
N13_PWR: IC8.2(GPB5) Q48.1(G)
N13_RESET: IC18.29(PC6(/RESET)) P17.5 R71.1
N14_5V: C49.1 IC15.4(VCC) IC15.6(VCC) IC15.18(AVCC) IC15.20(AREF) P14.2 Q39.1(G) Q40.1(G) Q49.3(D) R59.2 R61.2 R62.2 U$125.5(A-R) U$125.6(A-G) ; supply symbol labelled 5V
N14_A4_SDA: IC15.27(PC4(ADC4/SDA)) Q39.2(S) R61.1
N14_A5_SCL: IC15.28(PC5(ADC5/SCL)) Q40.2(S) R62.1
N14_D0_RX: IC15.30(PD0(RXD)) RN13.3 U$59.17(Y14)
N14_D1_TX: IC15.31(PD1(TXD)) RN13.2 U$60.17(Y14)
N14_D11_MOSI: IC15.15(PB3(MOSI/OC2)) P14.4
N14_D12_MISO: IC15.16(PB4(MISO)) P14.1
N14_D13_SCK: IC15.17(PB5(SCK)) P14.3 U$125.4(A-B)
N14_PWR: IC8.3(GPB6) Q49.1(G)
N14_RESET: IC15.29(PC6(/RESET)) P14.5 R59.1
N15_5V: C50.1 IC16.4(VCC) IC16.6(VCC) IC16.18(AVCC) IC16.20(AREF) P15.2 Q41.1(G) Q42.1(G) Q50.3(D) R63.2 R65.2 R66.2 U$133.5(A-R) U$133.6(A-G) ; supply symbol labelled 5V
N15_A4_SDA: IC16.27(PC4(ADC4/SDA)) Q41.2(S) R65.1
N15_A5_SCL: IC16.28(PC5(ADC5/SCL)) Q42.2(S) R66.1
N15_D0_RX: IC16.30(PD0(RXD)) RN14.3 U$59.16(Y15)
N15_D1_TX: IC16.31(PD1(TXD)) RN14.2 U$60.16(Y15)
N15_D11_MOSI: IC16.15(PB3(MOSI/OC2)) P15.4
N15_D12_MISO: IC16.16(PB4(MISO)) P15.1
N15_D13_SCK: IC16.17(PB5(SCK)) P15.3 U$133.4(A-B)
N15_PWR: IC8.4(GPB7) Q50.1(G)
N15_RESET: IC16.29(PC6(/RESET)) P15.5 R63.1
N$1: C5.2 IC2.8(PB7(XTAL2/TOSC2)) R8.1 U$15.3(XTL2)
N$2: C2.2 IC1.7(PB6(XTAL1/TOSC1)) R6.2 U$1.1(XTL1)
N$3: C1.2 IC2.7(PB6(XTAL1/TOSC1)) R8.2 U$15.1(XTL1)
N$4: RN4.6 U$9.3(C-G)
N$5: RN4.7 U$9.2(C-R)
N$6: RN4.8 U$9.1(C-B)
N$7: C3.2 IC1.8(PB7(XTAL2/TOSC2)) R6.1 U$1.3(XTL2)
N$8: RN1.6 U$16.3(C-G)
N$9: RN1.7 U$16.2(C-R)
N$10: RN1.8 U$16.1(C-B)
N$11: C8.2 IC3.8(PB7(XTAL2/TOSC2)) R13.1 U$28.3(XTL2)
N$12: C7.2 IC3.7(PB6(XTAL1/TOSC1)) R13.2 U$28.1(XTL1)
N$13: RN2.7 U$29.2(C-R)
N$14: LED4.C R10.2
N$15: RN2.6 U$29.3(C-G)
N$16: RN2.8 U$29.1(C-B)
N$17: C11.2 IC4.8(PB7(XTAL2/TOSC2)) R17.1 U$37.3(XTL2)
N$18: C10.2 IC4.7(PB6(XTAL1/TOSC1)) R17.2 U$37.1(XTL1)
N$19: RN3.6 U$38.3(C-G)
N$20: RN3.7 U$38.2(C-R)
N$21: RN3.8 U$38.1(C-B)
N$22: C14.2 IC7.8(PB7(XTAL2/TOSC2)) R32.1 U$53.3(XTL2)
N$23: C13.2 IC7.7(PB6(XTAL1/TOSC1)) R32.2 U$53.1(XTL1)
N$24: C16.2 IC5.8(PB7(XTAL2/TOSC2)) R25.1 U$48.3(XTL2)
N$26: C6.2 IC5.7(PB6(XTAL1/TOSC1)) R25.2 U$48.1(XTL1)
N$39: RN5.6 U$49.3(C-G)
N$41: RN5.7 U$49.2(C-R)
N$42: RN5.8 U$49.1(C-B)
N$90: IC8.14(!RESET)
N$113: C18.2 IC6.8(PB7(XTAL2/TOSC2)) R30.1 U$64.3(XTL2)
N$114: C17.2 IC6.7(PB6(XTAL1/TOSC1)) R30.2 U$64.1(XTL1)
N$115: RN6.6 U$65.3(C-G)
N$117: RN6.7 U$65.2(C-R)
N$126: RN6.8 U$65.1(C-B)
N$182: C20.2 IC9.8(PB7(XTAL2/TOSC2)) R36.1 U$72.3(XTL2)
N$192: C19.2 IC9.7(PB6(XTAL1/TOSC1)) R36.2 U$72.1(XTL1)
N$193: C23.2 IC10.8(PB7(XTAL2/TOSC2)) R40.1 U$80.3(XTL2)
N$194: C22.2 IC10.7(PB6(XTAL1/TOSC1)) R40.2 U$80.1(XTL1)
N$195: RN8.8 U$81.1(C-B)
N$196: RN8.6 U$81.3(C-G)
N$201: RN8.7 U$81.2(C-R)
N$202: RN7.7 U$73.2(C-R)
N$214: RN7.6 U$73.3(C-G)
N$220: RN7.8 U$73.1(C-B)
N$226: C28.2 IC11.8(PB7(XTAL2/TOSC2)) R44.1 U$90.3(XTL2)
N$232: C27.2 IC11.7(PB6(XTAL1/TOSC1)) R44.2 U$90.1(XTL1)
N$233: C30.2 IC12.8(PB7(XTAL2/TOSC2)) R48.1 U$98.3(XTL2)
N$234: C29.2 IC12.7(PB6(XTAL1/TOSC1)) R48.2 U$98.1(XTL1)
N$235: C32.2 IC13.8(PB7(XTAL2/TOSC2)) R52.1 U$106.3(XTL2)
N$248: C31.2 IC13.7(PB6(XTAL1/TOSC1)) R52.2 U$106.1(XTL1)
N$249: C35.2 IC14.8(PB7(XTAL2/TOSC2)) R56.1 U$114.3(XTL2)
N$250: C34.2 IC14.7(PB6(XTAL1/TOSC1)) R56.2 U$114.1(XTL1)
N$251: RN12.8 U$115.1(C-B)
N$252: RN12.6 U$115.3(C-G)
N$255: RN12.7 U$115.2(C-R)
N$299: RN11.7 U$107.2(C-R)
N$310: RN11.6 U$107.3(C-G)
N$311: RN11.8 U$107.1(C-B)
N$321: C40.2 IC15.8(PB7(XTAL2/TOSC2)) R60.1 U$124.3(XTL2)
N$338: C39.2 IC15.7(PB6(XTAL1/TOSC1)) R60.2 U$124.1(XTL1)
N$356: C42.2 IC16.8(PB7(XTAL2/TOSC2)) R64.1 U$132.3(XTL2)
N$367: C41.2 IC16.7(PB6(XTAL1/TOSC1)) R64.2 U$132.1(XTL1)
N$374: C44.2 IC17.8(PB7(XTAL2/TOSC2)) R68.1 U$140.3(XTL2)
N$378: C43.2 IC17.7(PB6(XTAL1/TOSC1)) R68.2 U$140.1(XTL1)
N$384: C47.2 IC18.8(PB7(XTAL2/TOSC2)) R72.1 U$148.3(XTL2)
N$416: C46.2 IC18.7(PB6(XTAL1/TOSC1)) R72.2 U$148.1(XTL1)
N$417: RN16.8 U$149.1(C-B)
N$418: RN16.6 U$149.3(C-G)
N$419: RN16.7 U$149.2(C-R)
N$420: RN15.7 U$141.2(C-R)
N$421: RN15.6 U$141.3(C-G)
N$422: RN15.8 U$141.1(C-B)
N$423: RN9.6 U$91.3(C-G)
N$424: RN9.7 U$91.2(C-R)
N$425: RN9.8 U$91.1(C-B)
N$426: RN10.6 U$99.3(C-G)
N$427: RN10.7 U$99.2(C-R)
N$428: RN10.8 U$99.1(C-B)
N$429: RN13.6 U$125.3(C-G)
N$430: RN13.7 U$125.2(C-R)
N$431: RN13.8 U$125.1(C-B)
N$432: RN14.6 U$133.3(C-G)
N$433: RN14.7 U$133.2(C-R)
N$434: RN14.8 U$133.1(C-B)
NODE_SCL: JP2.2 Q2.3(D) Q4.3(D) Q6.3(D) Q8.3(D) Q16.3(D) Q18.3(D) Q20.3(D) Q22.3(D) Q28.3(D) Q30.3(D) Q32.3(D) Q34.3(D) Q40.3(D) Q42.3(D) Q44.3(D) Q46.3(D) R21.1
NODE_SDA: JP2.1 Q1.3(D) Q3.3(D) Q5.3(D) Q7.3(D) Q15.3(D) Q17.3(D) Q19.3(D) Q21.3(D) Q27.3(D) Q29.3(D) Q31.3(D) Q33.3(D) Q39.3(D) Q41.3(D) Q43.3(D) Q45.3(D) R20.1
RX: JP3.2 U$59.1(Z)
S_A0: IC7.23(PC0(ADC0)) U$59.10(S0) U$60.10(S0)
S_A1: IC7.24(PC1(ADC1)) U$59.11(S1) U$60.11(S1)
S_A2: IC7.25(PC2(ADC2)) U$59.14(S2) U$60.14(S2)
S_A3: IC7.26(PC3(ADC3)) U$59.13(S3) U$60.13(S3)
S_A4_SDA: IC7.27(PC4(ADC4/SDA)) Q11.2(S) R22.1
S_A5_SCL: IC7.28(PC5(ADC5/SCL)) Q12.2(S) R23.1
S_A6: IC7.19(ADC6) R33.1 U$59.15(EN) U$60.15(EN)
S_A7: IC7.22(ADC7)
S_D0: IC7.30(PD0(RXD))
S_D1: IC7.31(PD1(TXD))
S_D2: IC7.32(PD2(INT0))
S_D3: IC7.1(PD3(INT1))
S_D4: IC7.2(PD4(XCK/T0))
S_D5: IC7.9(PD5(T1))
S_D6: IC7.10(PD6(AIN0))
S_D7: IC7.11(PD7(AIN1))
S_D8: IC7.12(PB0(ICP))
S_D9: IC7.13(PB1(OC1A))
S_D10: IC7.14(PB2(SS/OC1B)) IC8.7(!CS)
S_D11_MOSI: IC7.15(PB3(MOSI/OC2)) IC8.9(SI) P5.4
S_D12_MISO: IC7.16(PB4(MISO)) IC8.10(SO) P5.1
S_D13_SCK: IC7.17(PB5(SCK)) IC8.8(SCK) P5.3
S_RESET: IC7.29(PC6(/RESET)) P5.5 R26.1
TX: JP3.1 U$60.1(Z)
VCC_SYS: H2.27 H2.28 ; supply symbol labelled 3.3V
Unconnected: IC1.1(PD3(INT1)) IC1.2(PD4(XCK/T0)) IC1.9(PD5(T1)) IC1.10(PD6(AIN0)) IC1.11(PD7(AIN1)) IC1.12(PB0(ICP)) IC1.13(PB1(OC1A)) IC1.14(PB2(SS/OC1B)) IC1.19(ADC6) IC1.22(ADC7) IC1.23(PC0(ADC0)) IC1.24(PC1(ADC1)) IC1.25(PC2(ADC2)) IC1.26(PC3(ADC3)) IC1.32(PD2(INT0)) IC2.1(PD3(INT1)) IC2.2(PD4(XCK/T0)) IC2.9(PD5(T1)) IC2.10(PD6(AIN0)) IC2.11(PD7(AIN1)) IC2.12(PB0(ICP)) IC2.13(PB1(OC1A)) IC2.14(PB2(SS/OC1B)) IC2.19(ADC6) IC2.22(ADC7) IC2.23(PC0(ADC0)) IC2.24(PC1(ADC1)) IC2.25(PC2(ADC2)) IC2.26(PC3(ADC3)) IC2.32(PD2(INT0)) IC3.1(PD3(INT1)) IC3.2(PD4(XCK/T0)) IC3.9(PD5(T1)) IC3.10(PD6(AIN0)) IC3.11(PD7(AIN1)) IC3.12(PB0(ICP)) IC3.13(PB1(OC1A)) IC3.14(PB2(SS/OC1B)) IC3.19(ADC6) IC3.22(ADC7) IC3.23(PC0(ADC0)) IC3.24(PC1(ADC1)) IC3.25(PC2(ADC2)) IC3.26(PC3(ADC3)) IC3.32(PD2(INT0)) IC4.1(PD3(INT1)) IC4.2(PD4(XCK/T0)) IC4.9(PD5(T1)) IC4.10(PD6(AIN0)) IC4.11(PD7(AIN1)) IC4.12(PB0(ICP)) IC4.13(PB1(OC1A)) IC4.14(PB2(SS/OC1B)) IC4.19(ADC6) IC4.22(ADC7) IC4.23(PC0(ADC0)) IC4.24(PC1(ADC1)) IC4.25(PC2(ADC2)) IC4.26(PC3(ADC3)) IC4.32(PD2(INT0)) IC5.1(PD3(INT1)) IC5.2(PD4(XCK/T0)) IC5.9(PD5(T1)) IC5.10(PD6(AIN0)) IC5.11(PD7(AIN1)) IC5.12(PB0(ICP)) IC5.13(PB1(OC1A)) IC5.14(PB2(SS/OC1B)) IC5.19(ADC6) IC5.22(ADC7) IC5.23(PC0(ADC0)) IC5.24(PC1(ADC1)) IC5.25(PC2(ADC2)) IC5.26(PC3(ADC3)) IC5.32(PD2(INT0)) IC6.1(PD3(INT1)) IC6.2(PD4(XCK/T0)) IC6.9(PD5(T1)) IC6.10(PD6(AIN0)) IC6.11(PD7(AIN1)) IC6.12(PB0(ICP)) IC6.13(PB1(OC1A)) IC6.14(PB2(SS/OC1B)) IC6.19(ADC6) IC6.22(ADC7) IC6.23(PC0(ADC0)) IC6.24(PC1(ADC1)) IC6.25(PC2(ADC2)) IC6.26(PC3(ADC3)) IC6.32(PD2(INT0)) IC8.15(INTB) IC8.16(INTA) IC9.1(PD3(INT1)) IC9.2(PD4(XCK/T0)) IC9.9(PD5(T1)) IC9.10(PD6(AIN0)) IC9.11(PD7(AIN1)) IC9.12(PB0(ICP)) IC9.13(PB1(OC1A)) IC9.14(PB2(SS/OC1B)) IC9.19(ADC6) IC9.22(ADC7) IC9.23(PC0(ADC0)) IC9.24(PC1(ADC1)) IC9.25(PC2(ADC2)) IC9.26(PC3(ADC3)) IC9.32(PD2(INT0)) IC10.1(PD3(INT1)) IC10.2(PD4(XCK/T0)) IC10.9(PD5(T1)) IC10.10(PD6(AIN0)) IC10.11(PD7(AIN1)) IC10.12(PB0(ICP)) IC10.13(PB1(OC1A)) IC10.14(PB2(SS/OC1B)) IC10.19(ADC6) IC10.22(ADC7) IC10.23(PC0(ADC0)) IC10.24(PC1(ADC1)) IC10.25(PC2(ADC2)) IC10.26(PC3(ADC3)) IC10.32(PD2(INT0)) IC11.1(PD3(INT1)) IC11.2(PD4(XCK/T0)) IC11.9(PD5(T1)) IC11.10(PD6(AIN0)) IC11.11(PD7(AIN1)) IC11.12(PB0(ICP)) IC11.13(PB1(OC1A)) IC11.14(PB2(SS/OC1B)) IC11.19(ADC6) IC11.22(ADC7) IC11.23(PC0(ADC0)) IC11.24(PC1(ADC1)) IC11.25(PC2(ADC2)) IC11.26(PC3(ADC3)) IC11.32(PD2(INT0)) IC12.1(PD3(INT1)) IC12.2(PD4(XCK/T0)) IC12.9(PD5(T1)) IC12.10(PD6(AIN0)) IC12.11(PD7(AIN1)) IC12.12(PB0(ICP)) IC12.13(PB1(OC1A)) IC12.14(PB2(SS/OC1B)) IC12.19(ADC6) IC12.22(ADC7) IC12.23(PC0(ADC0)) IC12.24(PC1(ADC1)) IC12.25(PC2(ADC2)) IC12.26(PC3(ADC3)) IC12.32(PD2(INT0)) IC13.1(PD3(INT1)) IC13.2(PD4(XCK/T0)) IC13.9(PD5(T1)) IC13.10(PD6(AIN0)) IC13.11(PD7(AIN1)) IC13.12(PB0(ICP)) IC13.13(PB1(OC1A)) IC13.14(PB2(SS/OC1B)) IC13.19(ADC6) IC13.22(ADC7) IC13.23(PC0(ADC0)) IC13.24(PC1(ADC1)) IC13.25(PC2(ADC2)) IC13.26(PC3(ADC3)) IC13.32(PD2(INT0)) IC14.1(PD3(INT1)) IC14.2(PD4(XCK/T0)) IC14.9(PD5(T1)) IC14.10(PD6(AIN0)) IC14.11(PD7(AIN1)) IC14.12(PB0(ICP)) IC14.13(PB1(OC1A)) IC14.14(PB2(SS/OC1B)) IC14.19(ADC6) IC14.22(ADC7) IC14.23(PC0(ADC0)) IC14.24(PC1(ADC1)) IC14.25(PC2(ADC2)) IC14.26(PC3(ADC3)) IC14.32(PD2(INT0)) IC15.1(PD3(INT1)) IC15.2(PD4(XCK/T0)) IC15.9(PD5(T1)) IC15.10(PD6(AIN0)) IC15.11(PD7(AIN1)) IC15.12(PB0(ICP)) IC15.13(PB1(OC1A)) IC15.14(PB2(SS/OC1B)) IC15.19(ADC6) IC15.22(ADC7) IC15.23(PC0(ADC0)) IC15.24(PC1(ADC1)) IC15.25(PC2(ADC2)) IC15.26(PC3(ADC3)) IC15.32(PD2(INT0)) IC16.1(PD3(INT1)) IC16.2(PD4(XCK/T0)) IC16.9(PD5(T1)) IC16.10(PD6(AIN0)) IC16.11(PD7(AIN1)) IC16.12(PB0(ICP)) IC16.13(PB1(OC1A)) IC16.14(PB2(SS/OC1B)) IC16.19(ADC6) IC16.22(ADC7) IC16.23(PC0(ADC0)) IC16.24(PC1(ADC1)) IC16.25(PC2(ADC2)) IC16.26(PC3(ADC3)) IC16.32(PD2(INT0)) IC17.1(PD3(INT1)) IC17.2(PD4(XCK/T0)) IC17.9(PD5(T1)) IC17.10(PD6(AIN0)) IC17.11(PD7(AIN1)) IC17.12(PB0(ICP)) IC17.13(PB1(OC1A)) IC17.14(PB2(SS/OC1B)) IC17.19(ADC6) IC17.22(ADC7) IC17.23(PC0(ADC0)) IC17.24(PC1(ADC1)) IC17.25(PC2(ADC2)) IC17.26(PC3(ADC3)) IC17.32(PD2(INT0)) IC18.1(PD3(INT1)) IC18.2(PD4(XCK/T0)) IC18.9(PD5(T1)) IC18.10(PD6(AIN0)) IC18.11(PD7(AIN1)) IC18.12(PB0(ICP)) IC18.13(PB1(OC1A)) IC18.14(PB2(SS/OC1B)) IC18.19(ADC6) IC18.22(ADC7) IC18.23(PC0(ADC0)) IC18.24(PC1(ADC1)) IC18.25(PC2(ADC2)) IC18.26(PC3(ADC3)) IC18.32(PD2(INT0)) RN1.4 RN1.5 RN2.4 RN2.5 RN3.4 RN3.5 RN4.4 RN4.5 RN5.4 RN5.5 RN6.4 RN6.5 RN7.4 RN7.5 RN8.4 RN8.5 RN9.4 RN9.5 RN10.4 RN10.5 RN11.4 RN11.5 RN12.4 RN12.5 RN13.4 RN13.5 RN14.4 RN14.5 RN15.4 RN15.5 RN16.4 RN16.5

## Notes on the sheet
- CubeSat Bus Breakout | I2C Bias: Management Bus | I2C Bias: Node Bus | Supervisor | Node Comms Control
- http://arduino.cc/playground/Main/MCP23S17
- ATmega328P core consumes ~10mA at 5V / 16MHz
- MCP23017 can supply 25mA per output. Directly control node VCCs?
- Add watchdog (voltage + heartbeat?) to supervisor
- ATmega328P generates internal RESET pulse stretch
- What bus pins to use for UART, I2C, and MGMNT_I2C?
- Add bias for MGMNT_I2C | Node Power Control
- Bigger filter caps per node? | I2C Isolation
- Add status LEDs to the MUX address and enable lines?
- Pass through RESET for each node? Easy, but better perhaps
  to expose one of the Supervisor node I/O lines as a "virtual"
  reset line, which in turn toggles power to that node. That
  way the interface to this board externally just looks like TX,
  RX, and RESET, like any other Arduino. It would just need
  the node selected first
- (c) Copyright 2012 Freetronics Pty Ltd
- ArduSat Multiple Processor Module
- Released under the TAPR
- Open Hardware License
- www.freetronics.com/asmpm | SKU: ASMPM | V1.0 (2012-08-15)
- www.tapr.org/OHL
- Power Control | Status Display | ATmega328P Microcontroller | Power Control | Status Display | ATmega328P Microcontroller
- I2C Isolation | I2C Isolation
- Processor
- Processor
- Node 0
- Node 2
- Power Control | Status Display | ATmega328P Microcontroller | Power Control | Status Display | ATmega328P Microcontroller
- I2C Isolation | I2C Isolation
- Processor | Processor
- Node 1 | Node 3
- Power Control | Status Display | ATmega328P Microcontroller | Power Control | Status Display | ATmega328P Microcontroller
- I2C Isolation | I2C Isolation
- Processor
- Processor
- Node 4
- Node 6
- Power Control | Status Display | ATmega328P Microcontroller | Power Control | Status Display | ATmega328P Microcontroller
- I2C Isolation | I2C Isolation
- Processor | Processor
- Node 5 | Node 7
- Power Control | Status Display | ATmega328P Microcontroller | Power Control | Status Display | ATmega328P Microcontroller
- I2C Isolation | I2C Isolation
- Processor
- Processor
- Node 8
- Node 10
- Power Control | Status Display | ATmega328P Microcontroller | Power Control | Status Display | ATmega328P Microcontroller
- I2C Isolation | I2C Isolation
- Processor | Processor
- Node 9 | Node 11
- Power Control | Status Display | ATmega328P Microcontroller | Power Control | Status Display | ATmega328P Microcontroller
- I2C Isolation | I2C Isolation
- Processor
- Processor
- Node 12
- Node 14
- Power Control | Status Display | ATmega328P Microcontroller | Power Control | Status Display | ATmega328P Microcontroller
- I2C Isolation | I2C Isolation
- Processor | Processor
- Node 13 | Node 15

## Library data of the parts
C1-C50 = freetronics-master-v1.1:CAP: Capacitor Standard 0603 ceramic capacitor, and 0.1" leaded capacitor.
H1 H2 = freetronics-jon:CUBESATBUS
IC1-IC7 IC9-IC18 = freetronics-master-v1.1:AVR-MEGA8: MICROCONTROLLER 8 Kbytes FLASH 1 kbytes SRAM 512 bytes EEPROM USART 6-channel 10 bit ADC 2-channel 8 bit ADC
IC8 = freetronics-jon:MCP23S17: http://ww1.microchip.com/downloads/en/DeviceDoc/21952a.pdf Source: http://ww1.microchip.com/downloads/en/DeviceDoc/21952a.pdf; MF: MICROCHIP; MPN: MCP23S17-E/ML; OC_FARNELL: unknown; OC_NEWARK: 31K2949
JP1-JP3 = freetronics-master-v1.1:M02: Header 2 Standard 2-pin 0.1" header. Use with straight break away headers (SKU : PRT-00116), right angle break away headers (PRT-00553), swiss pins (PRT-00743), machine pins (PRT-00117), and female headers (PRT-00115). Molex polarized connector foot print use with SKU : PRT-08233 with associated crimp pins and housings.
LED4 = freetronics:LED: LEDs Standard schematic elements and footprints for 5mm, 3mm, 1206, and 0603 sized LEDs. 5mm - Spark Fun Electronics SKU : COM-00529 (and others)
P1-P17 = freetronics-jon:ICSP
Q1-Q50 = freetronics-master-v1:MOSFET-NCHANNEL
R1-R74 = freetronics-master-v1.1:RESISTOR: Resistor Basic schematic elements and footprints for 0603, 1206, and PTH 1/10th watt (small) resistors.
RN1-RN16 = resistor-dil:4R-N: Array Chip Resistor Source: RS Component / Phycomp; OC_FARNELL: unknown; OC_NEWARK: unknown
U$1 U$15 U$28 U$37 U$48 U$53 U$64 U$72 U$80 U$90 U$98 U$106 U$114 U$124 U$132 U$140 U$148 = freetronics-jon:CRYSTAL-GND
U$9 U$16 U$29 U$38 U$49 U$65 U$73 U$81 U$91 U$99 U$107 U$115 U$125 U$133 U$141 U$149 = freetronics-jon:RGBLED
U$21 U$22 = freetronics:FIDUCIAL: Fiducial Alignment Points Various fiducial points for machine vision alignment.
U$59 U$60 = freetronics-jon:MUX-74HC4067-QFN